# EasyEDA Pro project station_meteo.eprj

# Schematic Station branchement
Board Name: Board1; Create Date: 2025-09-25; Page Name: P1; Project Name: station_meteo; Schematic Name: Station branchement; Update Date: 2025-09-25; Company: EasyEDA.com; Page Size: A4; Version: V1.0
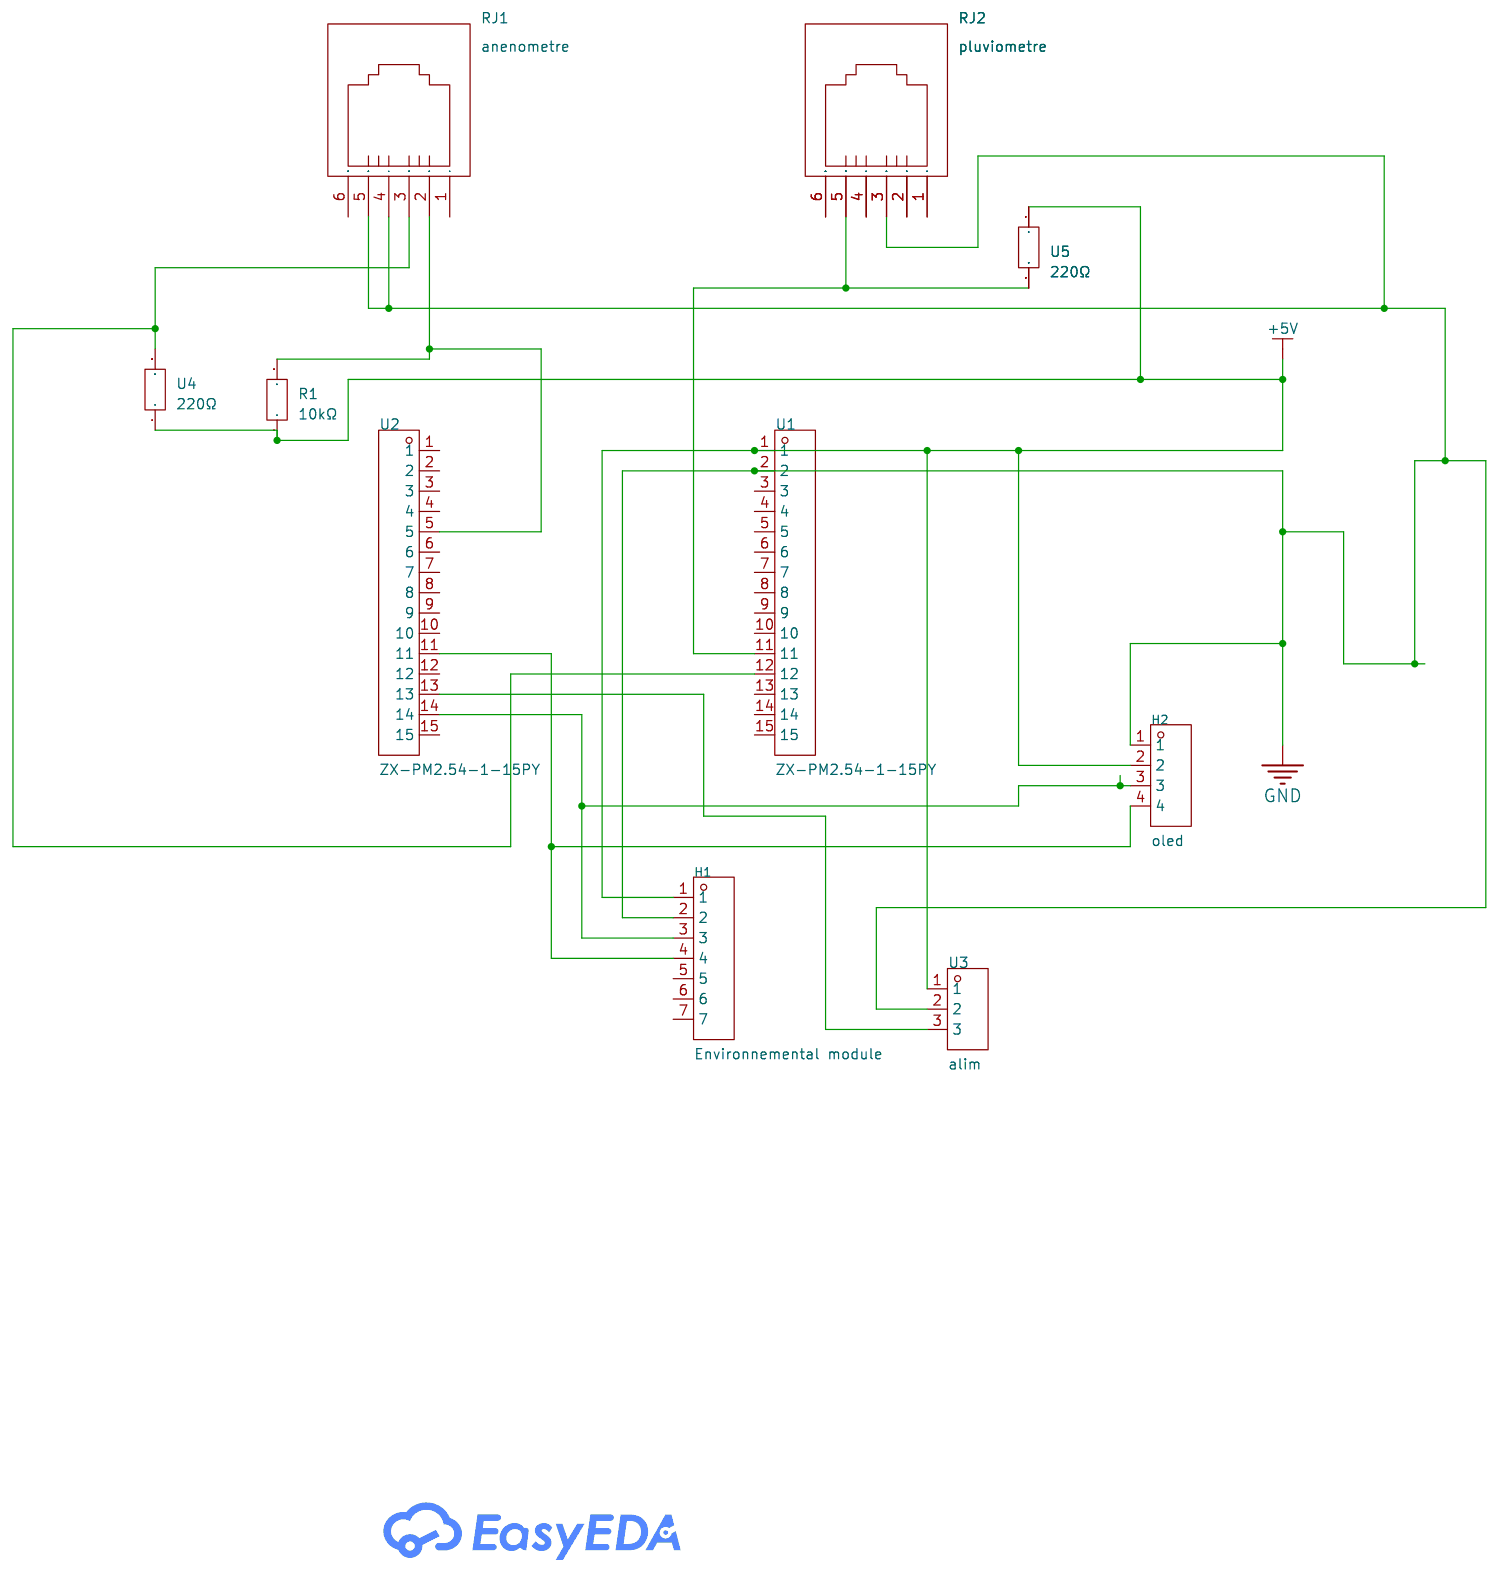
[diagram p0: schematic sheet]

## Parts
H1  Environnemental module  [HDR-TH_7P-P2.54-V-F]
H2  oled  [HDR-TH_4P-P2.54-V-F]
R1  10kΩ  [RES-TH_BD2.7-L6.2-P10.20-D0.4]
RJ1  anenometre  [RJ11-TH_DS1133-S60BPX]
RJ2  pluviometre  [RJ11-TH_DS1133-S60BPX]
U1  ZX-PM2.54-1-15PY  [HDR-TH_15P-P2.54-V-F]
U2  ZX-PM2.54-1-15PY  [HDR-TH_15P-P2.54-V-F]
U3  alim  [CONN-TH_3P-P5.08_DB128L-5.08-3P-BK-S]
U4  220Ω  [RES-TH_BD2.4-L6.3-P10.30-D0.6]
U5  220Ω  [RES-TH_BD2.4-L6.3-P10.30-D0.6]

## Library data of the parts
H1 = PM254V-11-07-H85: LCSC Part Name: 间距:2.54mm 1x7P 直插; Supplier Part: C2832270; Manufacturer: XFCN(兴飞); Supplier Footprint: 插件,P=2.54mm; JLCPCB Part Class: Extended Part; Datasheet: https://item.szlcsc.com/datasheet/PM254V-11-07-H85/2989788.html; Supplier: LCSC; Holes Structure: 1x7P; Pitch: 2.54mm; Circular Hole / Square Hole: Square Hole; Mounting Type: Through Hole; Number of Rows: 1; Number of Positions: 7P; Current Rating: 3A; Voltage Rating (Max): 250V; Holes Direction: Top; Operating Temperature: -40℃~+105℃
H2 = 2.54-1*4P母: LCSC Part Name: 间距:2.54mm 1x4P 直插; Supplier Part: C2718488; Manufacturer: BOOMELE(博穆精密); Supplier Footprint: 插件,P=2.54mm; JLCPCB Part Class: Extended Part; Datasheet: https://item.szlcsc.com/datasheet/2.54-1*4P%25E6%25AF%258D/2834502.html; Supplier: LCSC; Holes Structure: 1x4P; Pitch: 2.54mm; Circular Hole / Square Hole: Square Hole; Mounting Type: Through Hole; Number of Rows: 1; Number of Positions: 4P; Current Rating: 3A; Holes Direction: Top; Contact Material: Bronze; Operating Temperature: -40℃~+105℃
R1 = MF1/4W-10K±1%-ST52: LCSC Part Name: 金属膜电阻 10kΩ ±1% 250mW; Supplier Part: C2903232; Manufacturer: VO(翔胜); Supplier Footprint: 插件,D2.7xL6.2mm; JLCPCB Part Class: Extended Part; Datasheet: https://atta.szlcsc.com/upload/public/pdf/source/20200609/C601728_5AA4C0C8E12E11069DA2C3356F29D1F2.pdf; Supplier: LCSC; Type: Metal Film Resistor; Tolerance: ±1%; Voltage-Supply(Max): 250V; Power(Watts): 250mW; Temperature Coefficient: ±100ppm/℃; Operating Temperature: -55℃~+155℃
RJ1 RJ2 = DS1133-S60BPX: Supplier Part: C77859; Manufacturer: CONNFLY; Supplier Footprint: 插件; JLCPCB Part Class: Extended Part; Datasheet: https://item.szlcsc.com/datasheet/DS1133-S60BPX/78993.html; Supplier: LCSC; Connector Type: RJ12 Jack; Number of Ports: 1
U1 U2 = ZX-PM2.54-1-15PY: LCSC Part Name: 1x15P 间距:2.54mm 直插; Supplier Part: C7499333; Manufacturer: Megastar(兆星); Supplier Footprint: 插件,P=2.54mm; JLCPCB Part Class: Extended Part; Datasheet: https://item.szlcsc.com/datasheet/ZX-PM2.54-1-15PY/8573994.html; Supplier: LCSC; Holes Structure: 1x15P; Pitch: 2.54mm; Circular Hole / Square Hole: Square Hole; Mounting Type: Through Hole; Number of Rows: 1; Number of Positions: 15P; Current Rating: 3A; Holes Direction: Top; Insulation Height: 8.5mm; Contact Plating: Gold; Operating Temperature: -40℃~+105℃; PIN Length: 3.2mm
U3 = DB128L-5.08-3P-BK-S: LCSC Part Name: 1x3P 5.08mm 直插 排数:1 每排P数:3; Supplier Part: C430602; Manufacturer: DORABO(地博电气); Supplier Footprint: 插件,P=5.08mm; JLCPCB Part Class: Extended Part; Datasheet: https://item.szlcsc.com/datasheet/DB128L-5.08-3P-BK-S/426247.html; Supplier: LCSC; Number of Positions or Pins: 1x3P; Pitch: 5.08mm; Color: Black; Mounting Type: Through Hole; Number of Pins: 3P; Number of Rows: 1; Number of PINs Per Row: 3; Screw Specification: M2; Current Rating: 16A; Voltage Rating (Max): 300V; Wire Gauge - AWG: 12~22; Wire Gauge - mm2: 2.5; Operating Temperature: -40℃~+105℃
U4 U5 = MFR-25FBF52-220R: LCSC Part Name: 金属膜电阻 220Ω ±1% 250mW; Supplier Part: C3537012; Manufacturer: YAGEO(国巨); Supplier Footprint: 插件,D2.4xL6.3mm; JLCPCB Part Class: Extended Part; Datasheet: https://atta.szlcsc.com/upload/public/pdf/source/20231121/B79DF093C3343C1C7D20BECE94D94E07.pdf; Supplier: LCSC; Type: Metal Film Resistors; Tolerance: ±1%; Power(Watts): 250mW; Temperature Coefficient: ±100ppm/℃; Operating Temperature Range: -55℃~+155℃

## Nets
+5V: H1.1 H2.2 R1.1 U1.1 U3.1 U4.1 U5.1
GND: H1.2 H2.1 RJ1.4 RJ1.5 RJ2.3 U1.2 U3.2
Net-(H1-3): H1.3 H2.3 U2.14
Net-(H1-4): H1.4 H2.4 U2.11
Net-(R1-2): R1.2 RJ1.2 U2.5
Net-(RJ1-3): RJ1.3 U1.12 U4.2
Net-(RJ2-5): RJ2.5 U1.11 U5.2
Net-(U2-13): U2.13 U3.3

Not connected (* = marked no-connect by the designer): H1 5 6 7; RJ1 1 6; RJ2 1 2 4 6; U1 3 4 5 6 7 8 9 10 13 14 15; U2 1 2 3 4 6 7 8 9 10 12 15

# Board PCB1
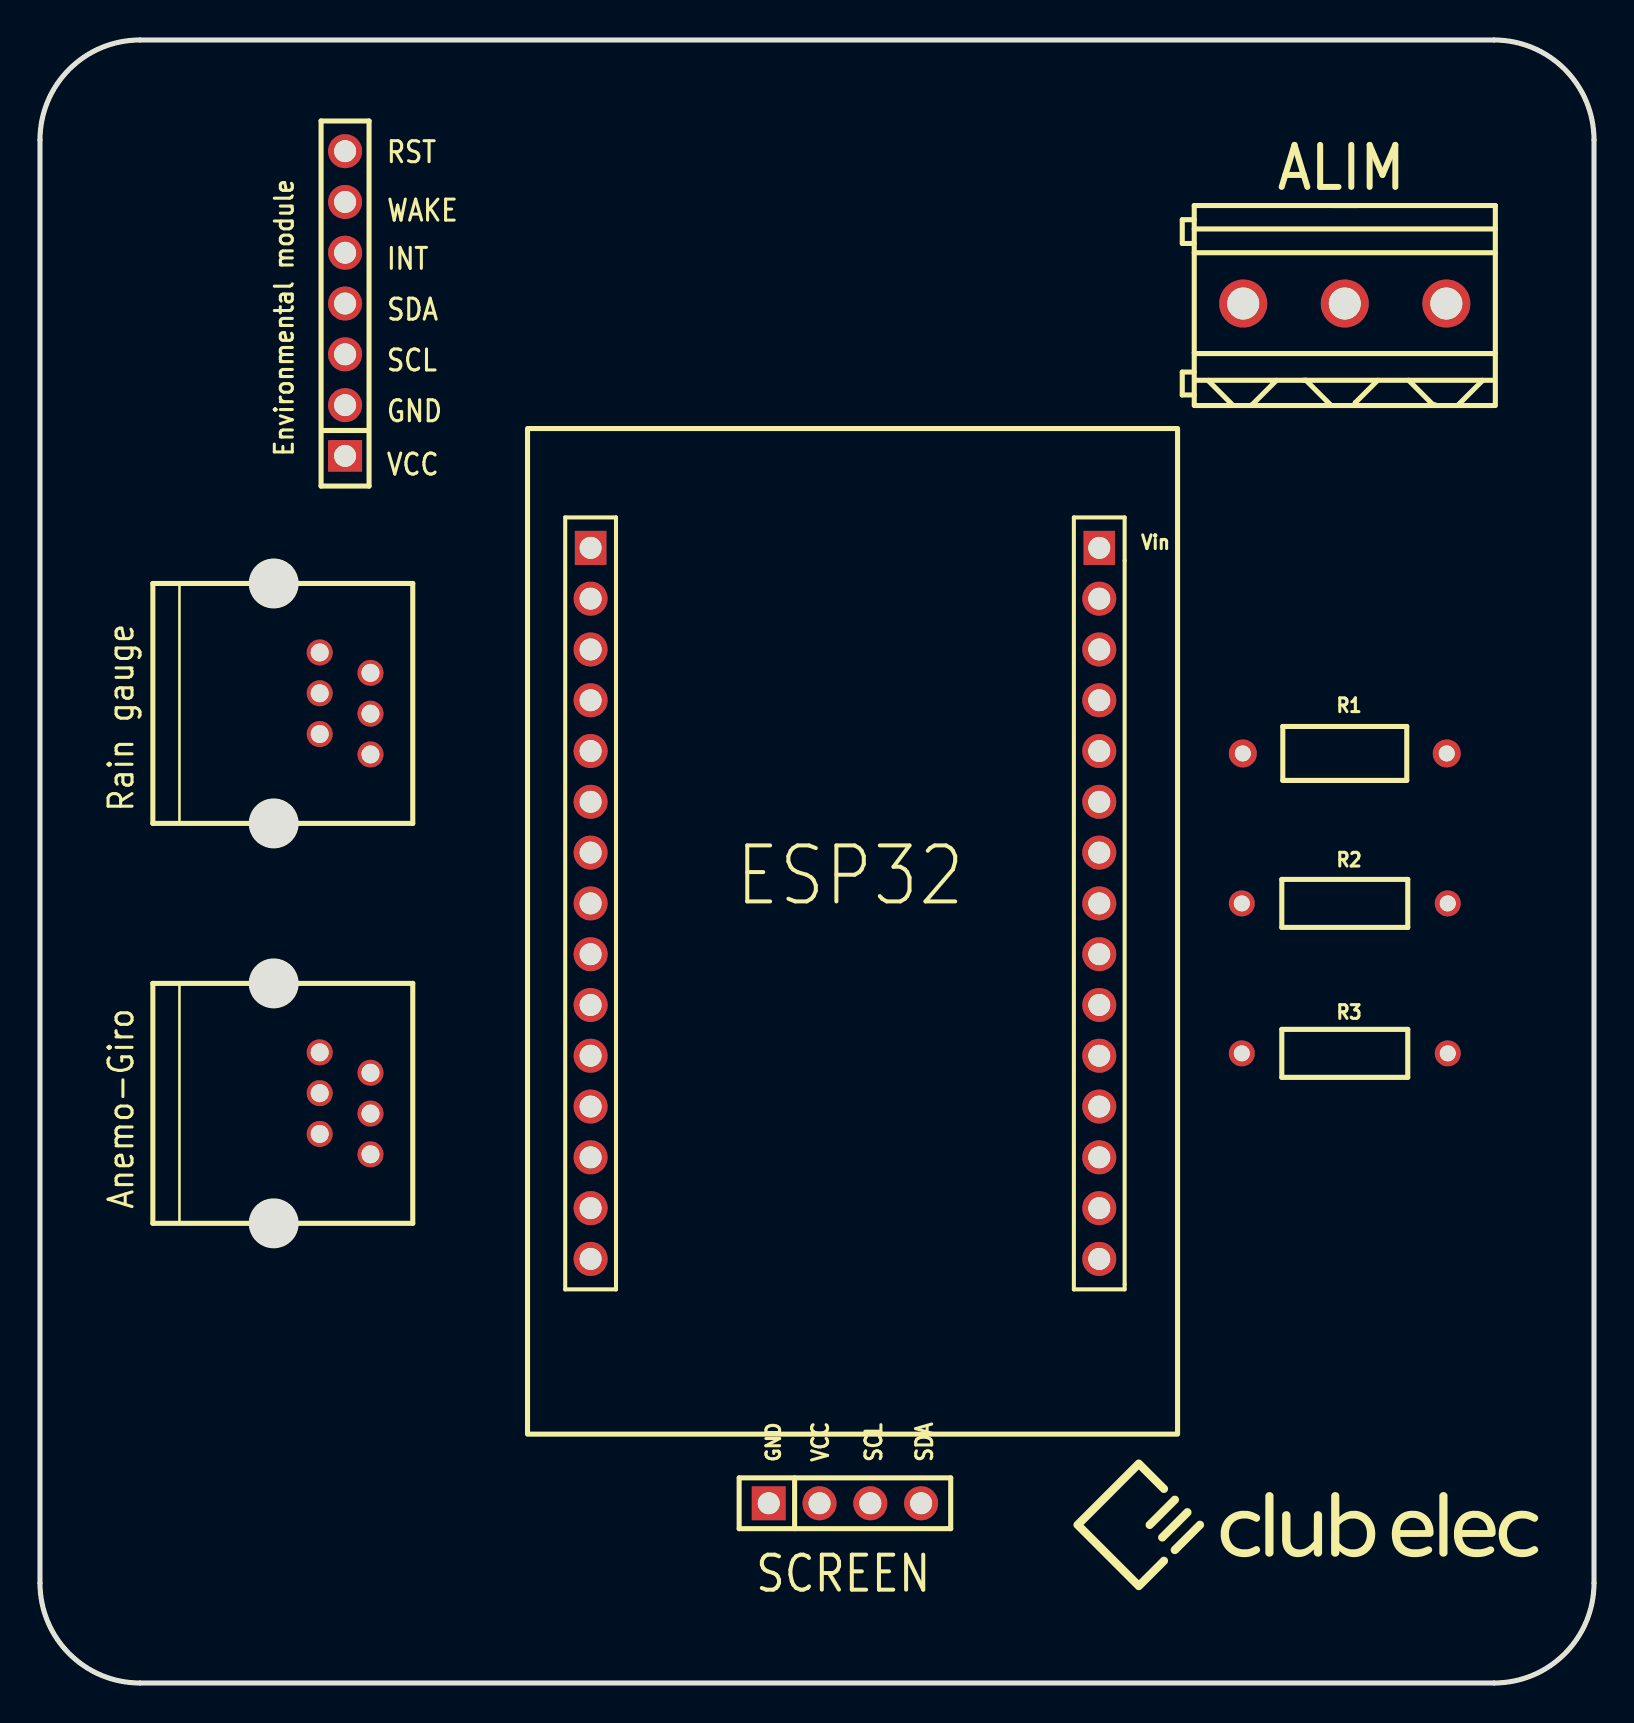
[diagram p1: board, top side]
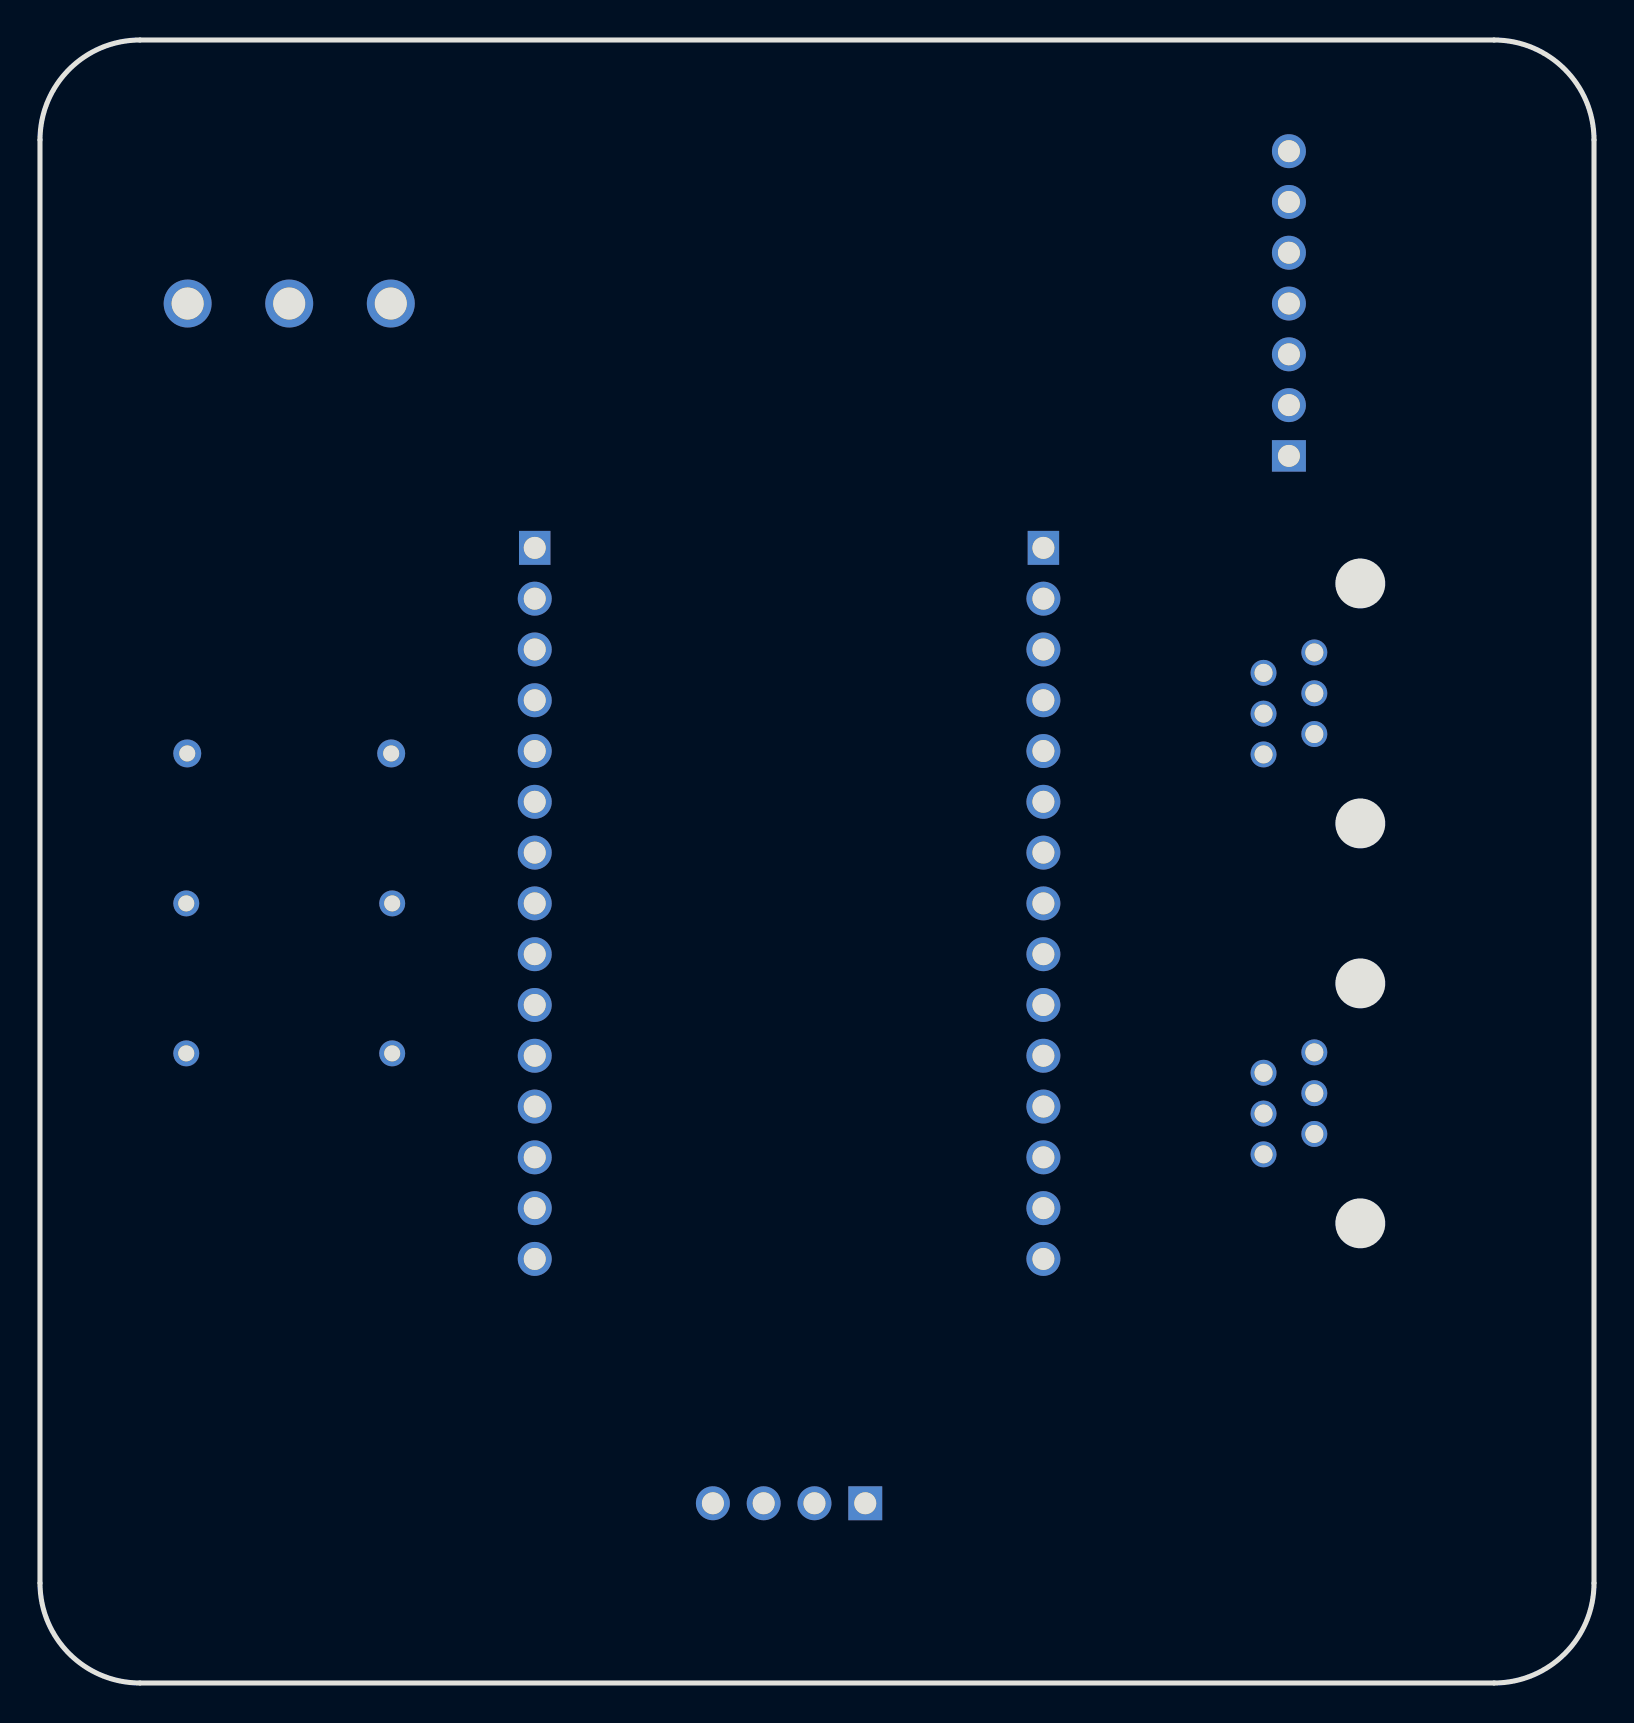
[diagram p2: board, bottom side, seen from below]

Outline 77.72 x 82.17 mm; copper layers: Top Layer, Bottom Layer. Coordinates in mm from the lower left corner of the outline.
Outline path: 0,77.17 0,5 arc(1.46,1.46) 5,0 72.72,0 arc(76.26,1.46) 77.72,5 77.72,77.17 arc(76.26,80.7) 72.72,82.17 5,82.17 arc(1.46,80.7) 0,77.17
Stack: Top Layer 0.035mm / Dielectric1 1.51mm FR4 er 4.5 / Bottom Layer 0.035mm

## Design rules (mm)
template: JLCPCB Capability(Two Layers Board)
spacing copperThickness1oz (default): track to track 0.102, other pairs 0.152 to 0.3
spacing copperThickness2oz: track to track 0.203, other pairs 0.152 to 0.3
track width copperThickness1oz (default): min 0.127, default 0.254, max 2.54
track width copperThickness2oz: min 0.203, default 0.254, max 2.54
differential pair differentialPair (default): width min 0.127, default 0.254, max 2.54; gap min 0.152, default 0.152
via viaSize (default): diameter min 0.5, default 0.61, max 10; hole min 0.3, default 0.305, max 6.3

## Placement (name value [footprint] x y rotation side)
ALIM  alim  [CONN-TH_3P-P5.08_DB128L-5.08-3P-BK-S]  65.26 68.99 0 top
Anemo-Giro  anenometre  [RJ11-TH_DS1133-S60BPX]  15.26 28.99 0 top
Environmental module  Environnemental module  [HDR-TH_7P-P2.54-V-F]  15.26 68.99 90 top
GND  oled  [HDR-TH_4P-P2.54-V-F]  40.26 8.99 0 top
R1  10kΩ  [RES-TH_BD2.7-L6.2-P10.20-D0.4]  65.26 46.49 0 top
R2  220Ω  [RES-TH_BD2.4-L6.3-P10.30-D0.6]  65.26 38.99 0 top
R3  220Ω  [RES-TH_BD2.4-L6.3-P10.30-D0.6]  65.26 31.49 0 top
Rain gauge  pluviometre  [RJ11-TH_DS1133-S60BPX]  15.26 48.99 0 top
U2  ZX-PM2.54-1-15PY  [HDR-TH_15P-P2.54-V-F]  27.54 38.99 270 top
Vin  ZX-PM2.54-1-15PY  [HDR-TH_15P-P2.54-V-F]  52.98 38.99 270 top

## Footprints (pads in the part's own frame, mm; a bottom-side part is the same pattern mirrored in y, then rotated)
CONN-TH_3P-P5.08_DB128L-5.08-3P-BK-S
  round 2.4 hole 1.6: 1(-5.08,0) 2(0,0) 3(5.08,0)
HDR-TH_4P-P2.54-V-F
  rect 1.7x1.7 hole 1.1: 1(-3.81,0)
  round 1.7 hole 1.1: 2(-1.27,0) 3(1.27,0) 4(3.81,0)
HDR-TH_7P-P2.54-V-F
  rect 1.575x1.7 hole 1.1: 1(-7.62,0)
  round 1.7 hole 1.1: 2(-5.08,0) 3(-2.54,0) 4(0,0) 5(2.54,0) 6(5.08,0) 7(7.62,0)
HDR-TH_15P-P2.54-V-F
  rect 1.7x1.575 hole 1.1: 1(-17.78,0)
  round 1.7 hole 1.1: 2(-15.24,0) 3(-12.7,0) 4(-10.16,0) 5(-7.62,0) 6(-5.08,0) 7(-2.54,0) 8(0,0) 9(2.54,0) 10(5.08,0) 11(7.62,0) 12(10.16,0) 13(12.7,0) 14(15.24,0) 15(17.78,0)
RES-TH_BD2.4-L6.3-P10.30-D0.6
  round 1.3 hole 0.8: 1(-5.15,0) 2(5.15,0)
RES-TH_BD2.7-L6.2-P10.20-D0.4
  round 1.4 hole 0.8: 1(-5.1,0) 2(5.1,0)
RJ11-TH_DS1133-S60BPX
  round 1.3 hole 0.9: 1(1.27,-2.55) 2(-1.27,-1.53) 3(1.27,-0.51) 4(-1.27,0.51) 5(1.27,1.53) 6(-1.27,2.55)

## Nets
+5V: ALIM.1 Environmental module.1 GND.2 R1.1 R2.1 R3.1 Vin.1
GND: ALIM.2 Anemo-Giro.4 Anemo-Giro.5 Environmental module.2 GND.1 Rain gauge.3 Vin.2
$1N1125: Environmental module.3 GND.3 U2.14
$1N1132: Environmental module.4 GND.4 U2.11
$1N1184: ALIM.3 U2.13
$1N1362: Anemo-Giro.3 R2.2 Vin.12
$1N1369: Anemo-Giro.2 R1.2 U2.5
$1N1375: R3.2 Rain gauge.5 Vin.11

Pads without a net: Anemo-Giro 1 6; Environmental module 5 6 7; Rain gauge 1 2 4 6; U2 1 2 3 4 6 7 8 9 10 12 15; Vin 3 4 5 6 7 8 9 10 13 14 15

## Text on the board
Top Silkscreen Layer: VCC | SCL | SDA | RST | INT | GND | WAKE | SCREEN | ESP32
